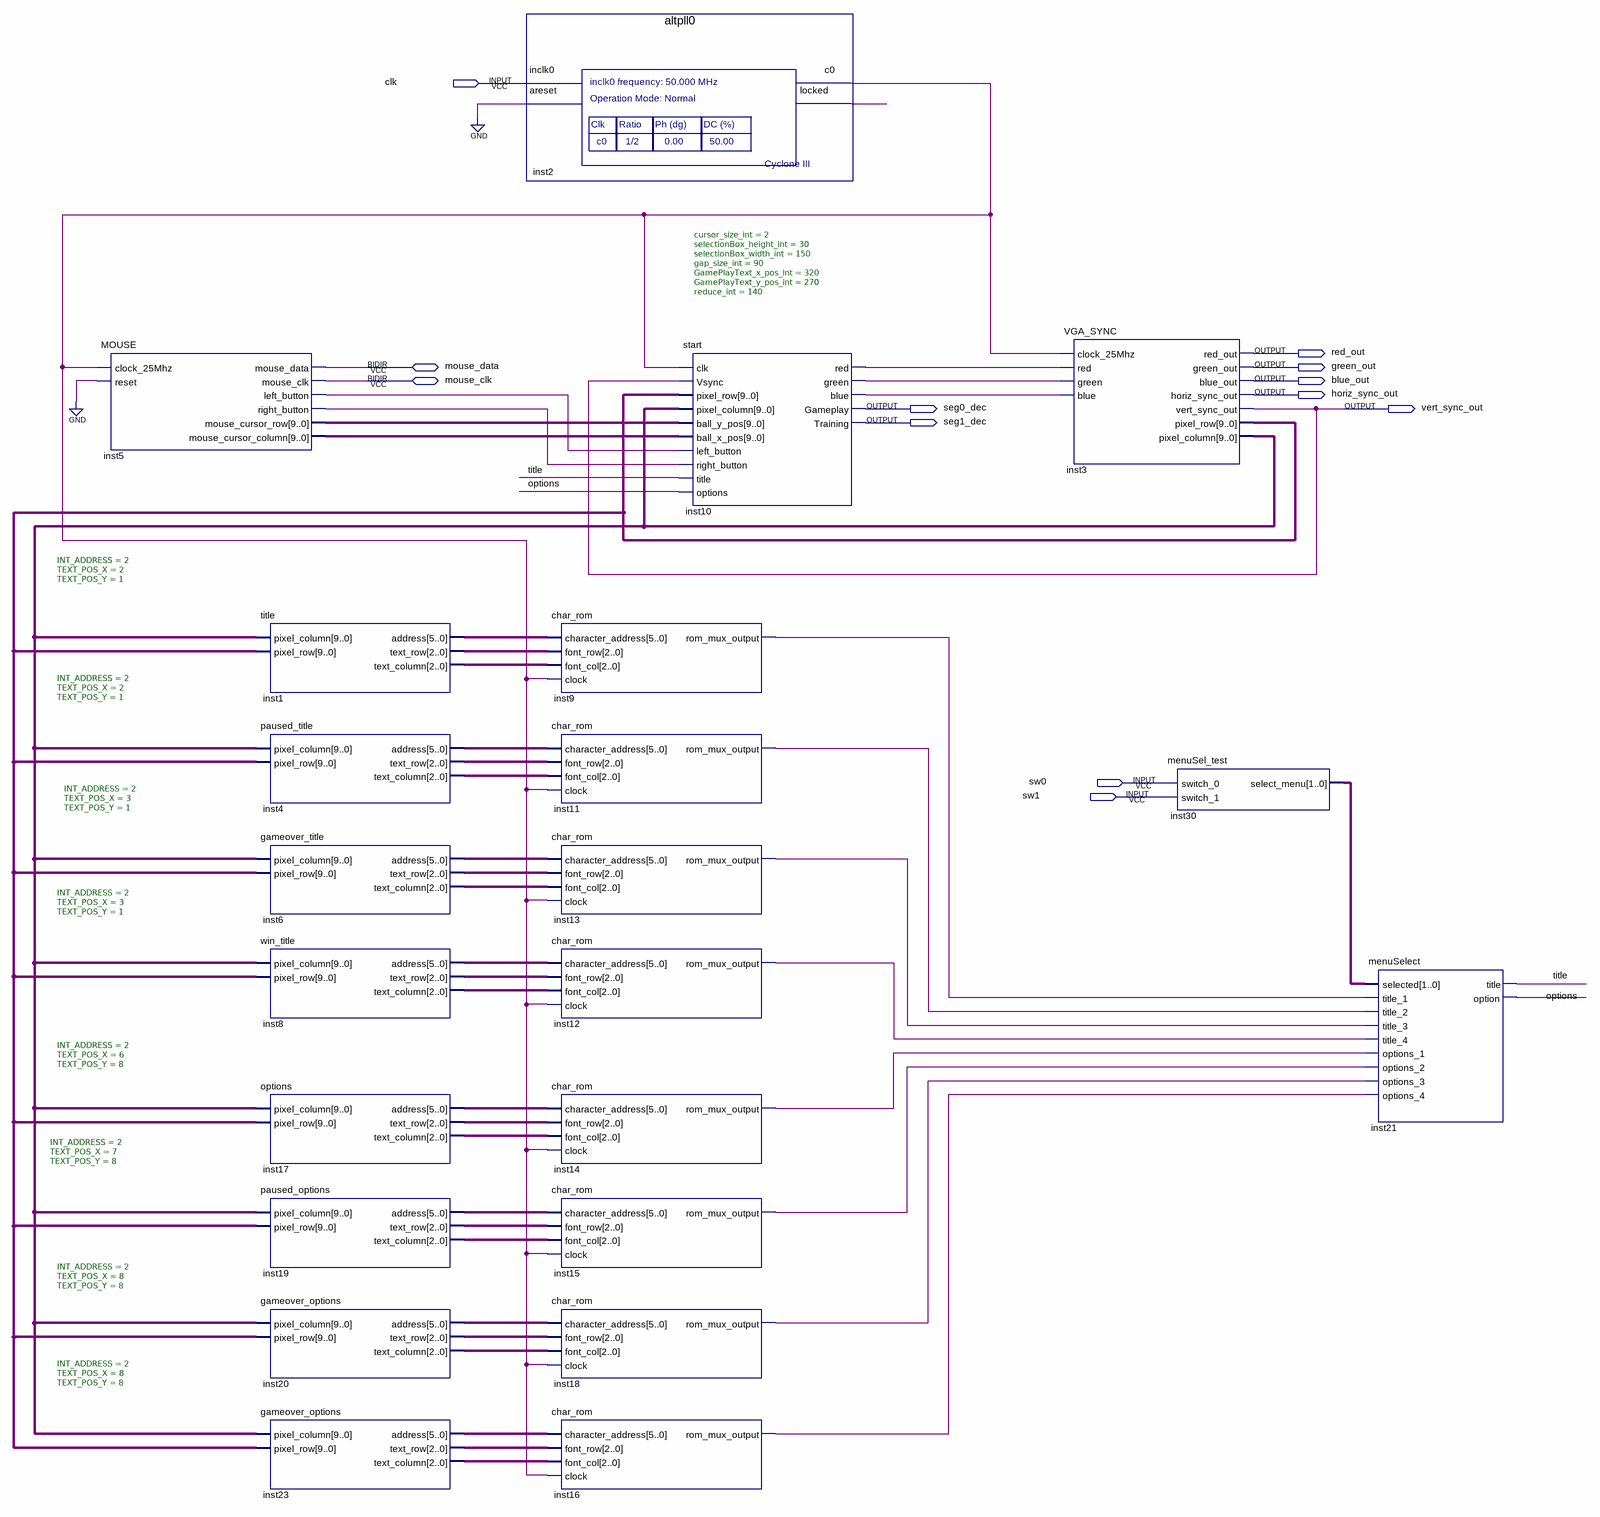
[diagram p0: schematic sheet]
// Quartus schematic menu_start.bdf as structural Verilog: 22 symbols, 12 pins
module menu_start (
  input  clk,
  input  sw0,
  input  sw1,
  inout  mouse_data,
  inout  mouse_clk,
  output red_out,
  output green_out,
  output blue_out,
  output horiz_sync_out,
  output seg0_dec,
  output vert_sync_out,
  output seg1_dec
);

  wire inst2_c0, inst2_locked, inst5_left_button, inst5_right_button, inst9_rom_mux_output, inst10_blue,
       inst10_green, inst10_red, inst11_rom_mux_output, inst12_rom_mux_output, inst13_rom_mux_output,
       inst14_rom_mux_output, inst15_rom_mux_output, inst16_rom_mux_output, inst18_rom_mux_output, options,
       title;
  wire [1:0] inst30_select_menu;
  wire [2:0] inst1_text_column, inst1_text_row, inst4_text_column, inst4_text_row, inst6_text_column,
       inst6_text_row, inst8_text_column, inst8_text_row, inst17_text_column, inst17_text_row,
       inst19_text_column, inst19_text_row, inst20_text_column, inst20_text_row, inst23_text_column,
       inst23_text_row;
  wire [5:0] inst1_address, inst4_address, inst6_address, inst8_address, inst17_address, inst19_address,
       inst20_address, inst23_address;
  wire [9:0] inst3_pixel_column, inst3_pixel_row, inst5_mouse_cursor_column, inst5_mouse_cursor_row;

  MOUSE inst5 (
    .clock_25Mhz(inst2_c0), .reset(1'b0), .left_button(inst5_left_button), .right_button(inst5_right_button),
    .mouse_cursor_row(inst5_mouse_cursor_row), .mouse_cursor_column(inst5_mouse_cursor_column),
    .mouse_data(mouse_data), .mouse_clk(mouse_clk));
  title #(.INT_ADDRESS(2), .TEXT_POS_X(2), .TEXT_POS_Y(1)) inst1 (
    .pixel_column(inst3_pixel_column), .pixel_row(inst3_pixel_row), .address(inst1_address),
    .text_row(inst1_text_row), .text_column(inst1_text_column));
  paused_title #(.INT_ADDRESS(2), .TEXT_POS_X(2), .TEXT_POS_Y(1)) inst4 (
    .pixel_column(inst3_pixel_column), .pixel_row(inst3_pixel_row), .address(inst4_address),
    .text_row(inst4_text_row), .text_column(inst4_text_column));
  gameover_title #(.INT_ADDRESS(2), .TEXT_POS_X(3), .TEXT_POS_Y(1)) inst6 (
    .pixel_column(inst3_pixel_column), .pixel_row(inst3_pixel_row), .address(inst6_address),
    .text_row(inst6_text_row), .text_column(inst6_text_column));
  win_title #(.INT_ADDRESS(2), .TEXT_POS_X(3), .TEXT_POS_Y(1)) inst8 (
    .pixel_column(inst3_pixel_column), .pixel_row(inst3_pixel_row), .address(inst8_address),
    .text_row(inst8_text_row), .text_column(inst8_text_column));
  options #(.INT_ADDRESS(2), .TEXT_POS_X(6), .TEXT_POS_Y(8)) inst17 (
    .pixel_column(inst3_pixel_column), .pixel_row(inst3_pixel_row), .address(inst17_address),
    .text_row(inst17_text_row), .text_column(inst17_text_column));
  paused_options #(.INT_ADDRESS(2), .TEXT_POS_X(7), .TEXT_POS_Y(8)) inst19 (
    .pixel_column(inst3_pixel_column), .pixel_row(inst3_pixel_row), .address(inst19_address),
    .text_row(inst19_text_row), .text_column(inst19_text_column));
  gameover_options #(.INT_ADDRESS(2), .TEXT_POS_X(8), .TEXT_POS_Y(8)) inst20 (
    .pixel_column(inst3_pixel_column), .pixel_row(inst3_pixel_row), .address(inst20_address),
    .text_row(inst20_text_row), .text_column(inst20_text_column));
  gameover_options #(.INT_ADDRESS(2), .TEXT_POS_X(8), .TEXT_POS_Y(8)) inst23 (
    .pixel_column(inst3_pixel_column), .pixel_row(inst3_pixel_row), .address(inst23_address),
    .text_row(inst23_text_row), .text_column(inst23_text_column));
  altpll0 inst2 (.inclk0(clk), .areset(1'b0), .c0(inst2_c0), .locked(inst2_locked));
  char_rom inst9 (
    .character_address(inst1_address), .font_row(inst1_text_row), .font_col(inst1_text_column),
    .clock(inst2_c0), .rom_mux_output(inst9_rom_mux_output));
  char_rom inst11 (
    .character_address(inst4_address), .font_row(inst4_text_row), .font_col(inst4_text_column),
    .clock(inst2_c0), .rom_mux_output(inst11_rom_mux_output));
  char_rom inst13 (
    .character_address(inst6_address), .font_row(inst6_text_row), .font_col(inst6_text_column),
    .clock(inst2_c0), .rom_mux_output(inst13_rom_mux_output));
  char_rom inst12 (
    .character_address(inst8_address), .font_row(inst8_text_row), .font_col(inst8_text_column),
    .clock(inst2_c0), .rom_mux_output(inst12_rom_mux_output));
  char_rom inst14 (
    .character_address(inst17_address), .font_row(inst17_text_row), .font_col(inst17_text_column),
    .clock(inst2_c0), .rom_mux_output(inst14_rom_mux_output));
  char_rom inst15 (
    .character_address(inst19_address), .font_row(inst19_text_row), .font_col(inst19_text_column),
    .clock(inst2_c0), .rom_mux_output(inst15_rom_mux_output));
  char_rom inst18 (
    .character_address(inst20_address), .font_row(inst20_text_row), .font_col(inst20_text_column),
    .clock(inst2_c0), .rom_mux_output(inst18_rom_mux_output));
  char_rom inst16 (
    .character_address(inst23_address), .font_row(inst23_text_row), .font_col(inst23_text_column),
    .clock(inst2_c0), .rom_mux_output(inst16_rom_mux_output));
  start #(.cursor_size_int(2), .selectionBox_height_int(30), .selectionBox_width_int(150), .gap_size_int(90), .GamePlayText_x_pos_int(320), .GamePlayText_y_pos_int(270), .reduce_int(140)) inst10 (
    .clk(inst2_c0), .Vsync(vert_sync_out), .pixel_row(inst3_pixel_row), .pixel_column(inst3_pixel_column),
    .ball_y_pos(inst5_mouse_cursor_row), .ball_x_pos(inst5_mouse_cursor_column),
    .left_button(inst5_left_button), .right_button(inst5_right_button), .title(title), .options(options),
    .red(inst10_red), .green(inst10_green), .blue(inst10_blue), .Gameplay(seg0_dec), .Training(seg1_dec));
  VGA_SYNC inst3 (
    .clock_25Mhz(inst2_c0), .red(inst10_red), .green(inst10_green), .blue(inst10_blue), .red_out(red_out),
    .green_out(green_out), .blue_out(blue_out), .horiz_sync_out(horiz_sync_out),
    .vert_sync_out(vert_sync_out), .pixel_row(inst3_pixel_row), .pixel_column(inst3_pixel_column));
  menuSel_test inst30 (.switch_0(sw0), .switch_1(sw1), .select_menu(inst30_select_menu));
  menuSelect inst21 (
    .selected(inst30_select_menu), .title_1(inst9_rom_mux_output), .title_2(inst11_rom_mux_output),
    .title_3(inst13_rom_mux_output), .title_4(inst12_rom_mux_output), .options_1(inst14_rom_mux_output),
    .options_2(inst15_rom_mux_output), .options_3(inst18_rom_mux_output), .options_4(inst16_rom_mux_output),
    .title(title), .option(options));
endmodule
